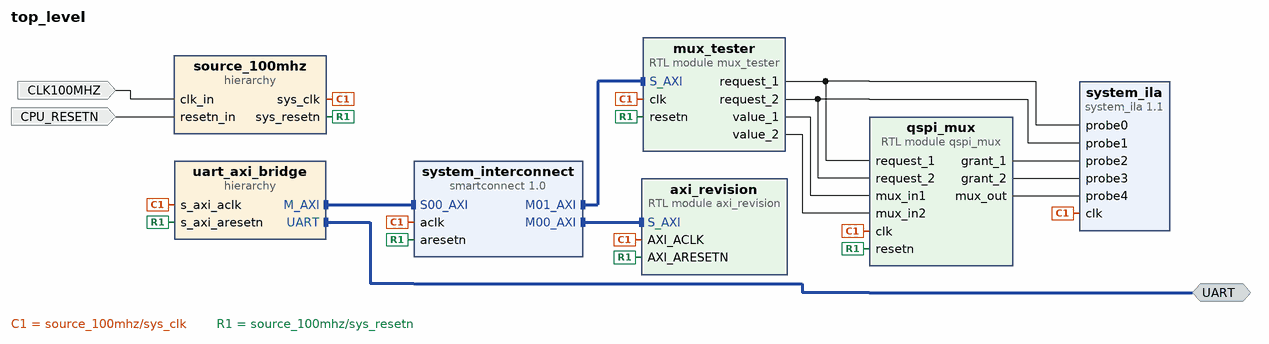
[diagram p0: block diagram of the top level]
# Vivado block design top_level, xc7a100tcsg324-1, Vivado 2021.1
create_bd_design top_level

create_bd_intf_port -mode Master -vlnv xilinx.com:interface:uart_rtl:1.0 UART
create_bd_port -dir I -type clk CLK100MHZ
create_bd_port -dir I -type rst CPU_RESETN

create_bd_cell -type hier source_100mhz
create_bd_cell -type hier uart_axi_bridge
create_bd_cell -type ip -vlnv xilinx.com:ip:smartconnect:1.0 system_interconnect
set_property -dict {CONFIG.NUM_MI 2 CONFIG.NUM_SI 1} [get_bd_cells system_interconnect]
create_bd_cell -type module -reference axi_revision axi_revision
create_bd_cell -type ip -vlnv xilinx.com:ip:system_ila:1.1 system_ila
set_property -dict {CONFIG.C_MON_TYPE NATIVE CONFIG.C_NUM_OF_PROBES 5} [get_bd_cells system_ila]
create_bd_cell -type module -reference mux_tester mux_tester
create_bd_cell -type module -reference qspi_mux qspi_mux

# ---- hierarchy /source_100mhz ----
current_bd_instance /source_100mhz
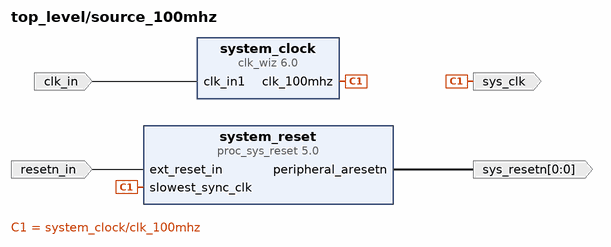
[diagram p1: block diagram inside /source_100mhz]
create_bd_pin -dir I -type clk clk_in
create_bd_pin -dir I -type rst resetn_in
create_bd_pin -dir O -type clk sys_clk
create_bd_pin -dir O -from 0 -to 0 sys_resetn

create_bd_cell -type ip -vlnv xilinx.com:ip:clk_wiz:6.0 system_clock
set_property -dict {CONFIG.CLK_OUT1_PORT clk_100mhz CONFIG.USE_LOCKED false CONFIG.USE_RESET false} [get_bd_cells system_clock]
create_bd_cell -type ip -vlnv xilinx.com:ip:proc_sys_reset:5.0 system_reset

# ---- hierarchy /uart_axi_bridge ----
current_bd_instance /uart_axi_bridge
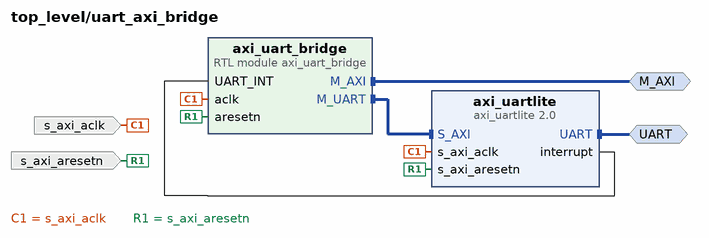
[diagram p2: block diagram inside /uart_axi_bridge]
create_bd_intf_pin -mode Master -vlnv xilinx.com:interface:uart_rtl:1.0 UART
create_bd_intf_pin -mode Master -vlnv xilinx.com:interface:aximm_rtl:1.0 M_AXI
create_bd_pin -dir I -type clk s_axi_aclk
create_bd_pin -dir I -type rst s_axi_aresetn

create_bd_cell -type module -reference axi_uart_bridge axi_uart_bridge
create_bd_cell -type ip -vlnv xilinx.com:ip:axi_uartlite:2.0 axi_uartlite
set_property -dict {CONFIG.C_BAUDRATE 115200} [get_bd_cells axi_uartlite]

# ---- connections ----

current_bd_instance /source_100mhz
connect_bd_net -net clk_in1_0_1 [get_bd_pins clk_in] [get_bd_pins system_clock/clk_in1]
connect_bd_net -net ext_reset_in_0_1 [get_bd_pins resetn_in] [get_bd_pins system_reset/ext_reset_in]
connect_bd_net [get_bd_pins system_clock/clk_100mhz] [get_bd_pins sys_clk] [get_bd_pins system_reset/slowest_sync_clk]
connect_bd_net [get_bd_pins system_reset/peripheral_aresetn] [get_bd_pins sys_resetn]

current_bd_instance /uart_axi_bridge
connect_bd_intf_net [get_bd_intf_pins M_AXI] [get_bd_intf_pins axi_uart_bridge/M_AXI]
connect_bd_intf_net [get_bd_intf_pins axi_uart_bridge/M_UART] [get_bd_intf_pins axi_uartlite/S_AXI]
connect_bd_intf_net [get_bd_intf_pins UART] [get_bd_intf_pins axi_uartlite/UART]
connect_bd_net [get_bd_pins axi_uartlite/interrupt] [get_bd_pins axi_uart_bridge/UART_INT]
connect_bd_net -net source_100mhz_sys_clk [get_bd_pins s_axi_aclk] [get_bd_pins axi_uartlite/s_axi_aclk] [get_bd_pins axi_uart_bridge/aclk]
connect_bd_net -net source_100mhz_sys_resetn [get_bd_pins s_axi_aresetn] \
  [get_bd_pins axi_uartlite/s_axi_aresetn] [get_bd_pins axi_uart_bridge/aresetn]

current_bd_instance /
connect_bd_intf_net -intf_net axi_uartlite_UART [get_bd_intf_ports UART] [get_bd_intf_pins uart_axi_bridge/UART]
connect_bd_intf_net [get_bd_intf_pins system_interconnect/M00_AXI] [get_bd_intf_pins axi_revision/S_AXI]
connect_bd_intf_net [get_bd_intf_pins system_interconnect/M01_AXI] [get_bd_intf_pins mux_tester/S_AXI]
connect_bd_intf_net [get_bd_intf_pins uart_axi_bridge/M_AXI] [get_bd_intf_pins system_interconnect/S00_AXI]
connect_bd_net -net clk_in1_0_1 [get_bd_ports CLK100MHZ] [get_bd_pins source_100mhz/clk_in]
connect_bd_net -net ext_reset_in_0_1 [get_bd_ports CPU_RESETN] [get_bd_pins source_100mhz/resetn_in]
connect_bd_net -net mux_tester_0_request_1 [get_bd_pins mux_tester/request_1] [get_bd_pins system_ila/probe0] [get_bd_pins qspi_mux/request_1]
connect_bd_net -net mux_tester_0_request_2 [get_bd_pins mux_tester/request_2] [get_bd_pins system_ila/probe1] [get_bd_pins qspi_mux/request_2]
connect_bd_net -net mux_tester_0_value_1 [get_bd_pins mux_tester/value_1] [get_bd_pins qspi_mux/mux_in1]
connect_bd_net -net mux_tester_0_value_2 [get_bd_pins mux_tester/value_2] [get_bd_pins qspi_mux/mux_in2]
connect_bd_net [get_bd_pins qspi_mux/grant_1] [get_bd_pins system_ila/probe2]
connect_bd_net [get_bd_pins qspi_mux/grant_2] [get_bd_pins system_ila/probe3]
connect_bd_net [get_bd_pins qspi_mux/mux_out] [get_bd_pins system_ila/probe4]
connect_bd_net [get_bd_pins source_100mhz/sys_clk] \
  [get_bd_pins uart_axi_bridge/s_axi_aclk] [get_bd_pins system_interconnect/aclk] [get_bd_pins axi_revision/AXI_ACLK] \
  [get_bd_pins system_ila/clk] [get_bd_pins mux_tester/clk] [get_bd_pins qspi_mux/clk]
connect_bd_net [get_bd_pins source_100mhz/sys_resetn] \
  [get_bd_pins uart_axi_bridge/s_axi_aresetn] [get_bd_pins system_interconnect/aresetn] \
  [get_bd_pins axi_revision/AXI_ARESETN] [get_bd_pins mux_tester/resetn] [get_bd_pins qspi_mux/resetn]

# ---- address map ----
assign_bd_address -offset 0x0000000000000000 -range 256 -target_address_space [get_bd_addr_spaces uart_axi_bridge/axi_uart_bridge/M_AXI] [get_bd_addr_segs axi_revision/S_AXI/reg0]
assign_bd_address -offset 0x0000000000001000 -range 256 -target_address_space [get_bd_addr_spaces uart_axi_bridge/axi_uart_bridge/M_AXI] [get_bd_addr_segs mux_tester/S_AXI/reg0]
assign_bd_address -offset 0x40600000 -range 64K -target_address_space [get_bd_addr_spaces uart_axi_bridge/axi_uart_bridge/M_UART] [get_bd_addr_segs uart_axi_bridge/axi_uartlite/S_AXI/Reg]

validate_bd_design
save_bd_design
